# Altium schematic sheet 02_USB_Bridge.SchDoc: USB Bridge
size A; Revision: A; SheetNumber: 2; SheetTotal: 10; ECE315_Project_Name: ECE453 Processor Mezzanine
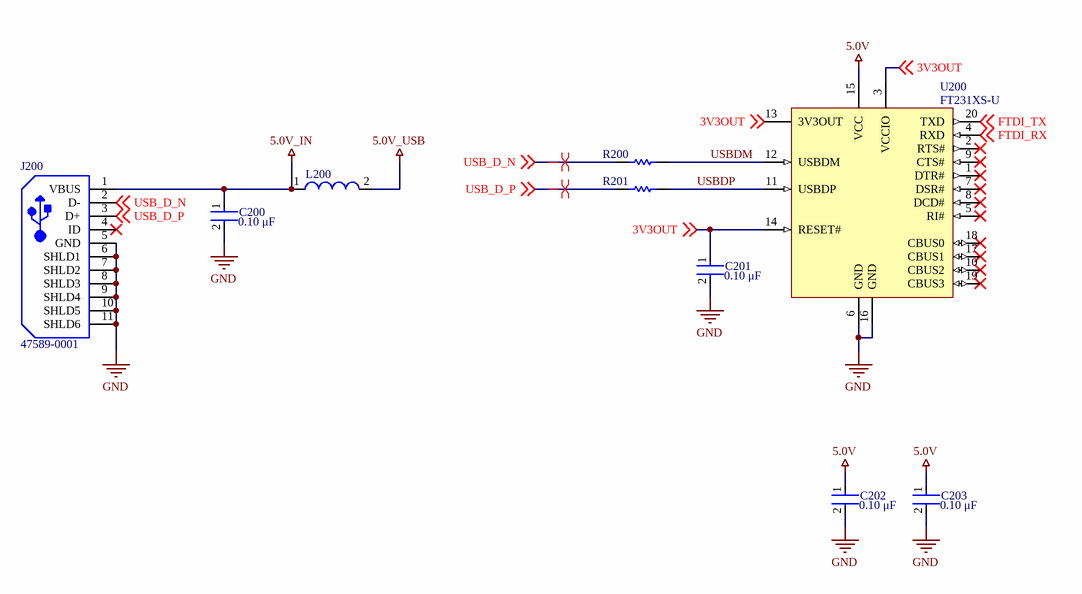
[diagram p0: 02_USB_Bridge.SchDoc]

## Parts
C200  value 0.10 μF  [FP-C0805C-DN-MFG]  (hidden comment: C0805C104K5RACTU)
C201  value 0.10 μF  [FP-C0805C-DN-MFG]  (hidden comment: C0805C104K5RACTU)
C202  value 0.10 μF  [FP-C0805C-DN-MFG]  (hidden comment: C0805C104K5RACTU)
C203  value 0.10 μF  [FP-C0805C-DN-MFG]  (hidden comment: C0805C104K5RACTU)
J200  47589-0001  [MOLX-47589-0001_V]
L200  742792093  [SMD-0805]  (value not drawn)
R200  ERJ6ENF27R0V  [RESC2013X70X40ML20T20]  (value not drawn)
R201  ERJ6ENF27R0V  [RESC2013X70X40ML20T20]  (value not drawn)
U200  FT231XS-U  [SSOP-20_L]

## Nets
5.0V: C202.1 C203.1 U200.15(VCC)
5.0V_IN: C200.1 J200.1(VBUS) L200.1
5.0V_USB: L200.2
GND: C200.2 C201.2 C202.2 C203.2 J200.5(GND) J200.6(SHLD1) J200.7(SHLD2) J200.8(SHLD3) J200.9(SHLD4) J200.10(SHLD5) J200.11(SHLD6) U200.6(GND) U200.16(GND)
3V3OUT: C201.1 U200.3(VCCIO) U200.13(3V3OUT) U200.14(RESET#) ; off-sheet 3V3OUT
FTDI_RX: U200.4(RXD) ; off-sheet FTDI_RX
FTDI_TX: U200.20(TXD) ; off-sheet FTDI_TX
USB_D_N: J200.2(D-) R200.1 ; off-sheet USB_D_N
USB_D_P: J200.3(D+) R201.1 ; off-sheet USB_D_P
USBDM: R200.2 U200.12(USBDM)
USBDP: R201.2 U200.11(USBDP)

Not connected (* = marked no-connect by the designer): J200 4(ID)*; U200 1(DTR#)* 2(RTS#)* 5(RI#)* 7(DSR#)* 8(DCD#)* 9(CTS#)* 10(CBUS2)* 17(CBUS1)* 18(CBUS0)* 19(CBUS3)*

## Layout directives
differential pair: USB_D_N, USB_D_P

## Notes on the sheet
- Title:
- Size:
- A
- Project
- Rev:
- Sheet:
- of
- College of Engineering
- 1415 Engineering Drive
- Madison, WI 53706

## Library data of the parts
C200-C203 = CMP-2007-00279-2: CAP CER 0.1UF 50V X7R 0805; Manufacturer: KEMET; Tolerance: 0.1; Temperature Coefficient: 30ppm/°C; Material: Ceramic; ComponentLink2Description: Datasheet; ComponentLink2URL: https://content.kemet.com/datasheets/KEM_C1003_C0G_SMD.pdf; Manufacturer Part Number: C0805C104K5RACTU; RoHS: TRUE; Category: Cap; Voltage Rating: 50 V; Height: 0.88mm; Device Class L2: Capacitors; Temperature Range Low: -55°C; Digikey Description: CAP CER 0.1UF 50V X7R 0805; Octopart: https://octopart.com/c0805c104k5ractu-kemet-143926; Temperature Characteristic: X7R; Temperature: -55°C to +125°C; Temperature Range High: +125°C; Device Class L1: Passive Components; Automotive: No; Lead Free: Yes; Ipc Land Pattern Name: CAPC200125X78; Device Class L3: Ceramic Capacitors; Mouser Description: Cap Ceramic 0.1uF 50V X7R 10% SMD 2.0 x 1.2 mm 125 C Paper T/R; Capacitance: 0.10 μF; Package: C0805C-DN
J200 = CMP-2000-05610-1: Right Angle Female Type AB Micro USB Connector, 30 V, 1.8 A, -30 to 85 degC, RoHS, Tape and Reel; Manufacturer: Molex; Voltage Rating: 30VAC; Current Rating: 1.8A; Connector Type: MicroUSBTypeABreceptacle; Number of Ports: 1Port; Number of Contacts: 5Contact; RoHS: True; Mounting Technology: SurfaceMount; Contact Plating: Gold; Contact Material: CopperAlloy; Color: Black; Packaging: Reel; Series: 47589; Gender: Female; Product: MicroUSBTypeABConnectors; Package URL: http://www.molex.com/pdm_docs/sd/475890001_sd.pdf; Datasheet URL: http://www.molex.com/webdocs/datasheets/pdf/en-us/0475890001_IO_CONNECTORS.pdf; Operating Temperature Range: -20Cto+85C; Termination Style: SMD/SMT; Brand: Molex; Mounting Angle: Right; Package Reference: 47589-0001; Package Description: Micro USB Connector, Pitch 0.65 mm, 5 Positions, Body 7.5 x 5.6 mm; Standard: USB; Manufacturer URL: http://www.molex.com/; Datasheet Version: 12/2016; Product Category: USBConnectors
L200 = CMP-0220-00169-1: SMD EMI Suppression Ferrite Bead WE-CBF, Z = 2200 Ohm; DatasheetVersion: Dec-2005; ComponentLink2URL: http://www.we-online.de/katalog/media/pdf/742792093.pdf; PackageDescription: Chip Inductor, 2-Leads, Body 2.0 x 1.2 mm; Impedance: 2200 Ohm; ComponentLink2Description: Datasheet; ComponentLink1Description: Manufacturer Link; PackageReference: SMD-0805; ComponentLink1URL: http://www.we-online.com; PackageVersion: 2005
R200 R201 = CMP-2001-00529-1: Manufacturer: Panasonic; Part Number: ERJ6ENF27R0V
U200 = CMP-0248-00015-2: USB to Full-Handshake UART Interface Chip, UHCI/OHCI/EHCI Compatible, USB 2.0 Compatible, -40 to +85 degC, 20-Pin SSOP, Pb-Free, Tube; Manufacturer: FTDI; ComponentLink1URL: http://www.ftdichip.com/; ComponentLink1Description: Manufacturer URL; ComponentLink2URL: http://www.ftdichip.com/Support/Documents/DataSheets/ICs/DS_FT231X.pdf; ComponentLink2Description: Datasheet; ComponentLink3URL: www.ftdichip.com/Products/ICs/FT231X.html; ComponentLink3Description: FT231X Product Page; PackageDescription: 20-Pin Small Outline Package, 8.6 x 3.9 mm Body, 0.635 mm Pitch; DatasheetVersion: ver 1.2, Feb-2013; PackageReference: SSOP-20; PartNumber: FT231XS-U; Code_JEDEC: MO-137-AD; RevisionNote: DatasheetVersion updated to 1.2 Feb-2013; PackageVersion: Feb-13